# Altium schematic sheet management-i2c.SchDoc: I2C IPMI
size A3; DocumentNumber: 3; SheetNumber: 3; SheetTotal: 9
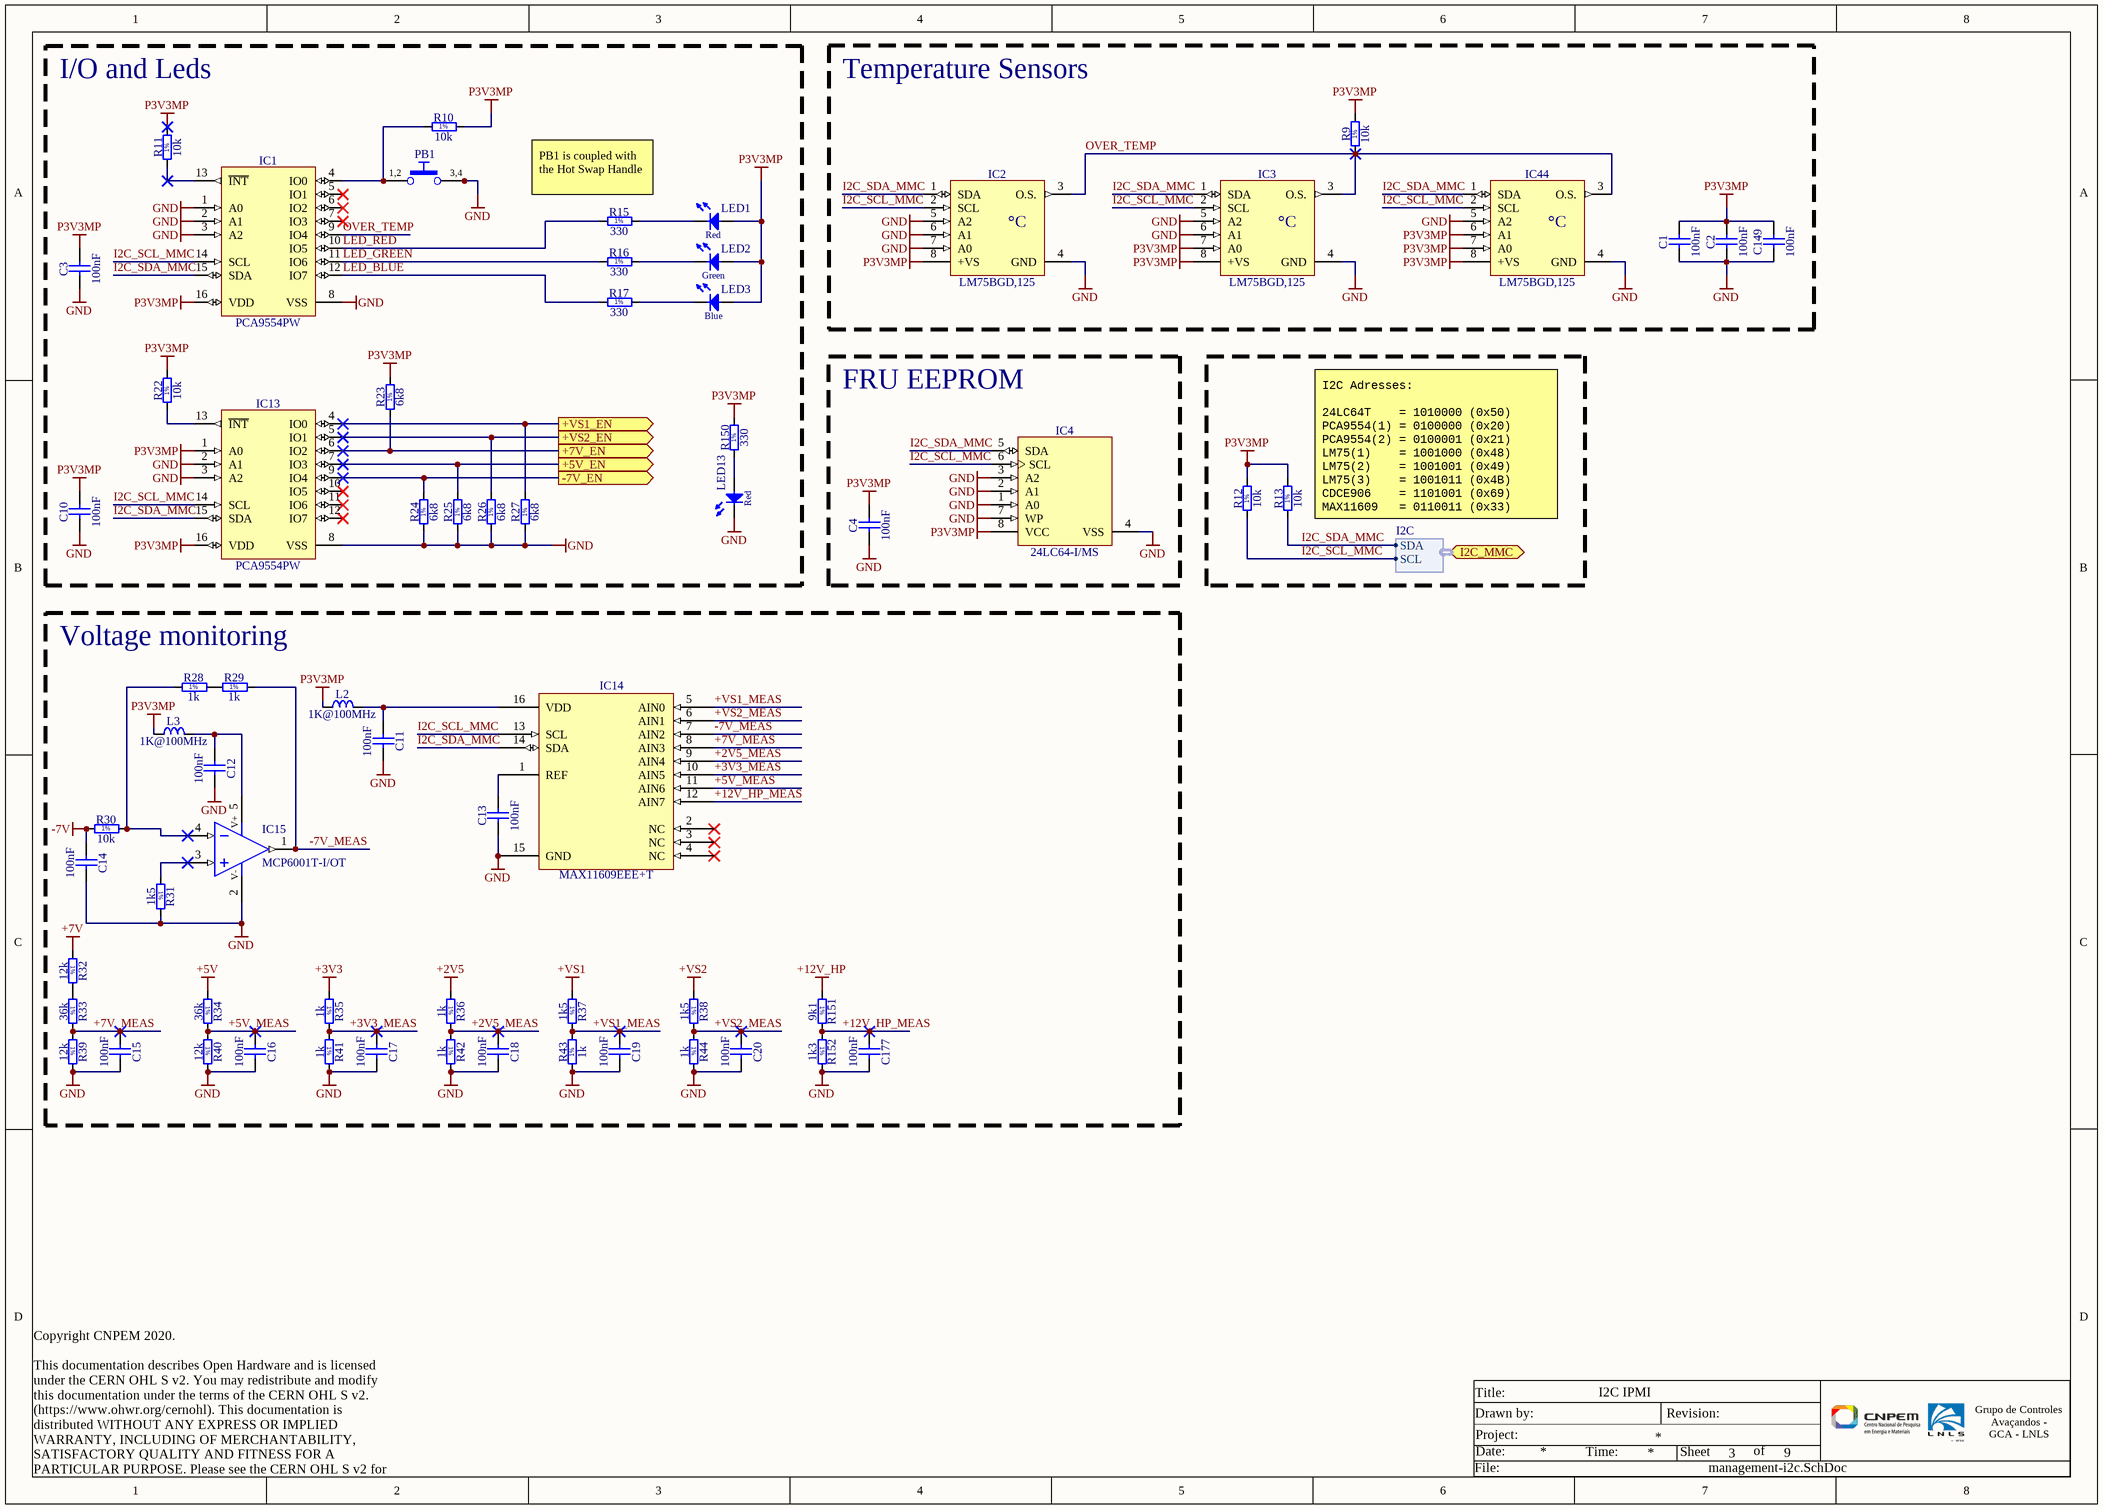
[diagram p0: management-i2c.SchDoc]

## Parts
C1  100nF  [CAPC1005X55N]
C2  100nF  [CAPC1005X55N]
C3  100nF  [CAPC1005X55N]
C4  100nF  [CAPC1005X55N]
C10  100nF  [CAPC1005X55N]
C11  100nF  [CAPC1005X55N]
C12  100nF  [CAPC1005X55N]
C13  100nF  [CAPC1005X55N]
C14  100nF  [CAPC1005X55N]
C15  100nF  [CAPC1005X55N]
C16  100nF  [CAPC1005X55N]
C17  100nF  [CAPC1005X55N]
C18  100nF  [CAPC1005X55N]
C19  100nF  [CAPC1005X55N]
C20  100nF  [CAPC1005X55N]
C149  100nF  [CAPC1005X55N]
C177  100nF  [CAPC1005X55N]
IC1  PCA9554PW  [SOP65P640X110-16N]
IC2  LM75BGD,125  [SON50P200X300X90-8N]
IC3  LM75BGD,125  [SON50P200X300X90-8N]
IC4  24LC64-I/MS  [SOP65P490X110-8N]
IC13  PCA9554PW  [SOP65P640X110-16N]
IC14  MAX11609EEE+T  [SOP65P640X110-16N]
IC15  MCP6001T-I/OT  [SOT95P270X145-5N]
IC44  LM75BGD,125  [SON50P200X300X90-8N]
L2  1K@100MHz  [INDC1608X95N]
L3  1K@100MHz  [INDC1608X95N]
LED1  Red  [LEDC1608X80N_RED]  (value not drawn)
LED2  Green  [LED_AVAGO_HSME-C120]  (value not drawn)
LED3  Blue  [LED_AVAGO_HSMR-C120]  (value not drawn)
LED13  Red  [LEDC1608X80N_RED]  (value not drawn)
PB1  Push Button  [SW_C&K_HDT0001]  (value not drawn)
R9  10k  [RESC1005X40N]
R10  10k  [RESC1005X40N]
R11  10k  [RESC1005X40N]
R12  10k  [RESC1005X40N]
R13  10k  [RESC1005X40N]
R15  330  [RESC1005X40N]
R16  330  [RESC1005X40N]
R17  330  [RESC1005X40N]
R22  10k  [RESC1005X40N]
R23  6k8  [RESC1005X40N]
R24  6k8  [RESC1005X40N]
R25  6k8  [RESC1005X40N]
R26  6k8  [RESC1005X40N]
R27  6k8  [RESC1005X40N]
R28  1k  [RESC1005X40N]
R29  1k  [RESC1005X40N]
R30  10k  [RESC1005X40N]
R31  1k5  [RESC1005X40N]
R32  12k  [RESC1005X40N]
R33  36k  [RESC1005X40N]
R34  36k  [RESC1005X40N]
R35  1k  [RESC1005X40N]
R36  1k  [RESC1005X40N]
R37  1k5  [RESC1005X40N]
R38  1k5  [RESC1005X40N]
R39  12k  [RESC1005X40N]
R40  12k  [RESC1005X40N]
R41  1k  [RESC1005X40N]
R42  1k  [RESC1005X40N]
R43  1k  [RESC1005X40N]
R44  1k  [RESC1005X40N]
R150  330  [RESC1005X40N]
R151  9k1  [RESC1005X40N]
R152  1k3  [RESC1005X40N]

## Blocks framed on the sheet
I/O and Leds: C3 C10 IC1 IC13 LED1-LED3 LED13 PB1 R10 R11 R15-R17 R22-R27 R150
Temperature Sensors: C1 C2 C149 IC2 IC3 IC44 R9
FRU EEPROM: C4 IC4
Voltage monitoring: C11-C20 C177 IC14 IC15 L2 L3 R28-R44 R151 R152

## Ports
+5V_EN (out), +7V_EN (out), +VS1_EN (out), +VS2_EN (out), -7V_EN (out), I2C_MMC (bidir, harness I2C)

## Harnesses
I2C: SDA, SCL

## Nets
+2V5: R36.1
+3V3: R35.1
+5V: R34.1
+7V: R32.1
+12V_HP: R151.1
+VS1: R37.1
+VS2: R38.1
-7V: C14.1 R30.1
GND: C1.1 C2.1 C3.1 C4.1 C10.1 C11.2 C12.2 C13.1 C14.2 C15.2 C16.2 C17.2 C18.2 C19.2 C20.2 C149.1 C177.2 IC1.1(A0) IC1.2(A1) IC1.3(A2) IC1.8(VSS) IC2.4(GND) IC2.5(A2) IC2.6(A1) IC2.7(A0) IC3.4(GND) IC3.5(A2) IC3.6(A1) IC4.1(A0) IC4.2(A1) IC4.3(A2) IC4.4(VSS) IC4.7(WP) IC13.2(A1) IC13.3(A2) IC13.8(VSS) IC14.15(GND) IC15.2(V-) IC44.4(GND) IC44.5(A2) LED13.1(C) PB1.3 PB1.4 R24.1 R25.1 R26.1 R27.1 R31.2 R39.2 R40.2 R41.2 R42.2 R43.1 R44.2 R152.2
P3V3MP: C1.2 C2.2 C3.2 C4.2 C10.2 C149.2 IC1.16(VDD) IC2.8(+VS) IC3.7(A0) IC3.8(+VS) IC4.8(VCC) IC13.1(A0) IC13.16(VDD) IC44.6(A1) IC44.7(A0) IC44.8(+VS) L2.1 L3.1 LED1.2(A) LED2.2(A) LED3.2(A) R9.2 R10.2 R11.2 R12.2 R13.2 R22.2 R23.2 R150.2
+2V5_MEAS: C18.1 IC14.9(AIN4) R36.2 R42.1
+3V3_MEAS: C17.1 IC14.10(AIN5) R35.2 R41.1
+5V_EN: IC13.7(IO3) R25.2 ; port +5V_EN
+5V_MEAS: C16.1 IC14.11(AIN6) R34.2 R40.1
+7V_EN: IC13.6(IO2) R23.1 ; port +7V_EN
+7V_MEAS: C15.1 IC14.8(AIN3) R33.2 R39.1
+12V_HP_MEAS: C177.1 IC14.12(AIN7) R151.2 R152.1
+VS1_EN: IC13.4(IO0) R27.2 ; port +VS1_EN
+VS1_MEAS: C19.1 IC14.5(AIN0) R37.2 R43.2
+VS2_EN: IC13.5(IO1) R26.2 ; port +VS2_EN
+VS2_MEAS: C20.1 IC14.6(AIN1) R38.2 R44.1
-7V_EN: IC13.9(IO4) R24.2 ; port -7V_EN
-7V_MEAS: IC14.7(AIN2) IC15.1(OUT) R29.2
I2C_SCL_MMC: IC1.14(SCL) IC2.2(SCL) IC3.2(SCL) IC4.6(SCL) IC13.14(SCL) IC14.13(SCL) IC44.2(SCL) R12.1 ; port I2C_MMC.SCL
I2C_SDA_MMC: IC1.15(SDA) IC2.1(SDA) IC3.1(SDA) IC4.5(SDA) IC13.15(SDA) IC14.14(SDA) IC44.1(SDA) R13.1 ; port I2C_MMC.SDA
LED_BLUE: IC1.12(IO7) R17.1
LED_GREEN: IC1.11(IO6) R16.1
LED_RED: IC1.10(IO5) R15.1
OVER_TEMP: IC1.9(IO4) IC2.3(O.S.) IC3.3(O.S.) IC44.3(O.S.) R9.1
NetC11_1: C11.1 IC14.16(VDD) L2.2
NetC12_1: C12.1 IC15.5(V+) L3.2
NetC13_2: C13.2 IC14.1(REF)
NetIC1_4: IC1.4(IO0) PB1.1 PB1.2 R10.1
NetIC1_13: IC1.13(~{INT}) R11.1
NetIC13_13: IC13.13(~{INT}) R22.1
NetIC15_3: IC15.3(IN+) R31.1
NetIC15_4: IC15.4(IN-) R28.1 R30.2
NetLED1_1: LED1.1(C) R15.2
NetLED2_1: LED2.1(C) R16.2
NetLED3_1: LED3.1(C) R17.2
NetLED13_2: LED13.2(A) R150.1
NetR28_2: R28.2 R29.1
NetR32_2: R32.2 R33.1

Not connected (* = marked no-connect by the designer): IC1 5(IO1)* 6(IO2)* 7(IO3)*; IC13 10(IO5)* 11(IO6)* 12(IO7)*; IC14 2(NC)* 3(NC)* 4(NC)*

## Notes on the sheet
- (near R15) PB1 is coupled with the Hot Swap Handle
- (near R13) I2C Adresses:
  24LC64T    = 1010000 (0x50)
  PCA9554(1) = 0100000 (0x20)
  PCA9554(2) = 0100001 (0x21)
  LM75(1)    = 1001000 (0x48)
  LM75(2)    = 1001001 (0x49)
  LM75(3)    = 1001011 (0x4B)
  CDCE906    = 1101001 (0x69)
  MAX11609   = 0110011 (0x33)
- Title:
- Date:
- Project:
- Drawn by:
- Time:
- Revision:
- Sheet
- of
- Grupo de Controles Avaçandos -
  GCA - LNLS
- Copyright CNPEM 2020.
  This documentation describes Open Hardware and is licensed under the CERN OHL S v2. You may redistribute and modify this documentation under the terms of the CERN OHL S v2. (https://www.ohwr.org/cernohl). This documentation is distributed WITHOUT ANY EXPRESS OR IMPLIED WARRANTY, INCLUDING OF MERCHANTABILITY, SATISFACTORY QUALITY AND FITNESS FOR A PARTICULAR PURPOSE. Please see the CERN OHL S v2 for applicable conditions.
- File:
- (in symbol LM75BGD,125) °C
- (in symbol R0402_1K3_1%_0.0625W_100PPM) 1%
- (in symbol R0402_1K5_1%_0.0625W_100PPM) 1%
- (in symbol R0402_1K_1%_0.0625W_100PPM) 1%
- (in symbol R0402_6K8_1%_0.0625W_100PPM) 1%
- (in symbol R0402_9K1_1%_0.0625W_100PPM) 1%
- (in symbol R0402_10K_1%_0.0625W_100PPM) 1%
- (in symbol R0402_12K_1%_0.0625W_100PPM) 1%
- (in symbol R0402_36K_1%_0.0625W_100PPM) 1%
- (in symbol R0402_330R_1%_0.0625W_100PPM) 1%
- (in symbol SW_C&K_HDT0001) 1,2; 3,4

## Library data of the parts
C1-C4 C10-C20 C149 C177 = CC0402_100NF_16V_10%_X7R: SMD Multilayer Chip Ceramic Capacitor; Manufacturer: GENERIC; Manufacturer1 Part Number: GRM155R71C104KA88D; Voltage: 16V; TC: X7R; Tolerance: ±10%; Part Number: CC0402_100NF_16V_10%_X7R; Component Kind: Standard; Component Type: Standard; Pin Count: 2; Value: 100nF; Status: Not Recommended; Manufacturer Part Number: CC0402_100NF_16V_10%_X7R; Case: 0402; Mounted: Yes; Socket: No; SMD: Yes; Sense: No; Manufacturer1 Example: MURATA; Manufacturer1 ComponentHeight: 0.55mm; HelpURL: \\cern.ch\dfs\Applications\Altium\Datasheets\CC0402_X7R_MURATA_GRM.pdf; Author: CERN DEM JLC; CreateDate: 05/12/2013; LatestRevisionDate: 03/12/2007
IC1 IC13 = PCA9554PW: 8-Bit I2C-Bus and SMBus I/O Port with Interrupt; Manufacturer: NXP SEMICONDUCTORS; PressFit: No; Bonding: No; Part Number: PCA9554PW; Component Kind: Standard; Component Type: Standard; Device: PCA9554PW; PackageDescription: SOP, 0.65mm pitch; 16 pin, 4.40mm W X 5.00mm L X 1.10mm H body IPC Medium Density; Manufacturer Part Number: PCA9554PW; Pin Count: 16; Case: TSSOP16; Mounted: Yes; Socket: No; SMD: Yes; Sense: No; ComponentHeight: 1.1mm; Author: CERN DEM JLC; HelpURL: \\cern.ch\dfs\Applications\Altium\Datasheets\PCA9554PW.pdf; CreateDate: 04/11/2014; LatestRevisionDate: 04/11/2014
IC2 IC3 IC44 = LM75BGD,125: I2C Digital temperature sensor and thermal watchdog; Manufacturer: NEXPERIA; PressFit: No; Bonding: No; Part Number: LM75BGD,125; Component Kind: Standard; Component Type: Standard; Device: LM75BGD,125; Footprint: XSON-8; PackageDescription: SON, 0.50mm Pitch; 8 Pin, 2.00mm W X 3.00mm L X 0.50mm H body, IPC Medium Density; Manufacturer Part Number: LM75BGD,125; Pin Count: 8; Case: XSON-8; Mounted: Yes; Socket: No; SMD: Yes; Sense: No; ComponentHeight: 0.5mm; Author: LNLS DIG AFG; CreateDate: 06/07/2020; LatestRevisionDate: 06/07/2020
IC4 = 24LC64-I/MS: 2.5V-5.5V, 64K (8K x 8-bit) I2C Serial EEPROM; Manufacturer: MICROCHIP TECHNOLOGY; Bonding: No; PressFit: No; Part Number: 24LC64-I/MS; Component Kind: Standard; Component Type: Standard; Device: 24LC64-I/MS; PackageDescription: SOP, 0.65mm pitch; 8 pin, 3.00mm W X 3.00mm L X 1.10mm H body, IPC Medium Density; Manufacturer Part Number: 24LC64-I/MS; Pin Count: 8; Case: MSOP8; Mounted: Yes; Socket: No; SMD: Yes; ComponentHeight: 1.1mm; HelpURL: \\cern.ch\dfs\Applications\Altium\Datasheets\24LC64-I-MS.pdf; Author: CERN DEM JLC; CreateDate: 24/01/2011; LatestRevisionDate: 24/01/2011; Sense: No
IC14 = MAX11609EEE+T: Low-Power, 8-Channel, I2C, 10-Bit ADC in Ultra-Small Packages; Part Description: Low-Power, 8-Channel, I2C,  10-Bit ADCs in Ultra-Small Packages; Manufacturer: MAXIM; PressFit: No; Bonding: No; Part Number: MAX11609EEE+T; Component Kind: Standard; Component Type: Standard; Device: MAX11609EEE+T; PackageDescription: SOP, 0.65mm pitch; 16 pin, 4.40mm W X 5.00mm L X 1.10mm H body IPC Medium Density; Manufacturer Part Number: MAX11609EEE+T; Pin Count: 16; Case: QSOP-16; Mounted: Yes; Socket: No; SMD: Yes; Sense: No; ComponentHeight: 1.1mm; Author: LNLS DIG AFG; CreateDate: 12/06/2020; LatestRevisionDate: 12/06/2020
IC15 = MCP6001T-I/OT: 1MHz, Low-Power, Rail-To-Rail Operational Amplifier; Manufacturer: MICROCHIP; PressFit: No; Bonding: No; Part Number: MCP6001T-I/OT; Component Kind: Standard; Component Type: Standard; Device: MCP6001T-I/OT; PackageDescription: SOT, 0.95mm Pitch; 5 Pin,1.55mm W X 2.90mm L X 1.45mm H body, IPC Medium Density; Manufacturer Part Number: MCP6001T-I/OT; Pin Count: 5; Case: SOT-5; Mounted: Yes; Socket: No; SMD: Yes; Sense: No; ComponentHeight: 1.45mm; Author: LNLS DIG AFG; CreateDate: 15/06/2020; LatestRevisionDate: 15/06/2020
L2 L3 = IND0603_MURATA_BLM18AG102SN1D: SMD EMIFIL Suppression Chip Ferrite Bead; Manufacturer: MURATA; Power: 400mA; Resistance: 0.50R; Tolerance: ±25%; Part Number: IND0603_MURATA_BLM18AG102SN1D; Component Kind: Standard; Component Type: Standard; Pin Count: 2; Value: 1K@100MHz; Status: None; Manufacturer Part Number: BLM18AG102SN1D; Case: 0603; Mounted: Yes; Socket: No; SMD: Yes; Sense: No; ComponentHeight: 0.95mm; Author: LNLS DIG GBMB; CreateDate: 03/11/2017; LatestRevisionDate: 03/11/2017
LED1 LED13 = LED_AVAGO_HSMC-C190: High Performance ChipLED; Manufacturer: AVAGO; PressFit: No; Bonding: No; Part Number: LED_AVAGO_HSMC-C190; Component Kind: Standard; Component Type: Standard; Color: Red; PackageDescription: Chip Red LED, 2-Leads, Body 1.6x0.8mm, IPC Medium Density; Manufacturer Part Number: HSMC-C190; Pin Count: 2; Mounted: Yes; Socket: No; SMD: Yes; Sense: No; ComponentHeight: 0.8mm; Author: LNLS DIG AFG; CreateDate: 04/09/2020; LatestRevisionDate: 04/09/2020
LED2 = LED_AVAGO_HSME-C120: High Performance Right Angle Chip Green LED; Manufacturer: AVAGO TECHNOLOGIES; PressFit: No; Bonding: No; Part Number: LED_AVAGO_HSME-C120; Component Kind: Standard; Component Type: Standard; Color: Green; PackageDescription: Green Chip LED, 2-Leads, Body 1.7x1.1mm, Side Emitting Package; Manufacturer Part Number: HSME-C120; Pin Count: 2; Mounted: Yes; Socket: No; SMD: Yes; Sense: No; ComponentHeight: 0.7mm; HelpURL: \\cern.ch\dfs\Applications\Altium\Datasheets\LED_AVAGO_HSME-C120.pdf; ComponentLink1URL: \\cern.ch\dfs\Applications\Altium\Datasheets\LED_AVAGO_HSME-C110_DESIGN-GUIDE.pdf; ComponentLink1Description: Design Guide; Author: CERN DEM JMW; CreateDate: 22/07/2009; LatestRevisionDate: 20/06/2012
LED3 = LED_AVAGO_HSMR-C120: High Performance Right Angle Chip InGaN Blue LED; Manufacturer: AVAGO TECHNOLOGIES; PressFit: No; Bonding: No; Part Number: LED_AVAGO_HSMR-C120; Component Kind: Standard; Component Type: Standard; Color: Blue; Footprint: LED_AVAGO_HSME-C120; PackageDescription: Blue Chip LED, 2-Leads, Body 1.7x1.1mm, Side Emitting Package; Manufacturer Part Number: HSMR-C120; Pin Count: 2; Mounted: Yes; Socket: No; SMD: Yes; Sense: No; ComponentHeight: 0.7mm; HelpURL: \\cern.ch\dfs\Applications\Altium\Datasheets\LED_AVAGO_HSMR-C120.pdf; Author: CERN DEM JLC; CreateDate: 07/07/2014; LatestRevisionDate: 07/07/2014
PB1 = SW_C&K_HDT0001: 5VDC 1mA SPST-NO Micro Mini Surface Surface Mount Detect Push-Button Switch, HDT Serie; Manufacturer: C&K; PressFit: No; Part Number: SW_C&K_HDT0001; Component Kind: Standard; Component Type: Standard; Pin Count: 4; PackageDescription: Body 3.5x2.8mm, Micro Mini Surface Mount Detect Switches, HDT Serie; Family: Push Button; Mounted: Yes; Socket: No; SMD: Yes; Status: None; Manufacturer Part Number: HDT0001; ComponentHeight: 3.35mm; HelpURL: \\cern.ch\dfs\Applications\Altium\Datasheets\SW_C&K_HDT0001.pdf; Author: CERN DEM JLC; CreateDate: 15/08/2012; LatestRevisionDate: 15/08/2012; Sense: No
R9-R13 R22 R30 = R0402_10K_1%_0.0625W_100PPM: General Purpose Thick Film Chip Resistor; Manufacturer: GENERIC; Manufacturer1 Part Number: 232270671003L; TC: ±100ppm/°C; Tolerance: ±1%; Part Number: R0402_10K_1%_0.0625W_100PPM; Component Kind: Standard; Component Type: Standard; Pin Count: 2; Value: 10k; Status: Not recommended; Power: 0.0625W; Manufacturer Part Number: R0402_10K_1%_0.0625W_100PPM; Case: 0402; Mounted: Yes; Sense: No; Socket: No; SMD: Yes; Manufacturer1 Example: YAGEO PHYCOMP; Manufacturer1 ComponentHeight: 0.4mm; HelpURL: \\cern.ch\dfs\Applications\Altium\Datasheets\R0402_Phycomp_RC0402.pdf; Author: CERN DEM JLC; CreateDate: 03/12/2007; LatestRevisionDate: 17/10/2012
R15-R17 R150 = R0402_330R_1%_0.0625W_100PPM: General Purpose Thick Film Chip Resistor; Manufacturer: GENERIC; Manufacturer1 Part Number: 232270673301L; TC: ±100ppm/°C; Tolerance: ±1%; Part Number: R0402_330R_1%_0.0625W_100PPM; Component Kind: Standard; Component Type: Standard; Pin Count: 2; Value: 330; Status: Not recommended; Power: 0.0625W; Manufacturer Part Number: R0402_330R_1%_0.0625W_100PPM; Case: 0402; Mounted: Yes; Socket: No; SMD: Yes; Manufacturer1 Example: YAGEO PHYCOMP; Manufacturer1 ComponentHeight: 0.4mm; HelpURL: \\cern.ch\dfs\Applications\Altium\Datasheets\R0402_Phycomp_RC0402.pdf; Author: CERN DEM JLC; CreateDate: 03/12/2007; LatestRevisionDate: 17/10/2012; Sense: No
R23-R27 = R0402_6K8_1%_0.0625W_100PPM: General Purpose Thick Film Chip Resistor; Manufacturer: GENERIC; Manufacturer1 Part Number: 232270676802L; TC: ±100ppm/°C; Tolerance: ±1%; Part Number: R0402_6K8_1%_0.0625W_100PPM; Component Kind: Standard; Component Type: Standard; Pin Count: 2; Value: 6k8; Status: Not recommended; Power: 0.0625W; Manufacturer Part Number: R0402_6K8_1%_0.0625W_100PPM; Case: 0402; Mounted: Yes; Sense: No; Socket: No; SMD: Yes; Manufacturer1 Example: YAGEO PHYCOMP; Manufacturer1 ComponentHeight: 0.4mm; HelpURL: \\cern.ch\dfs\Applications\Altium\Datasheets\R0402_Phycomp_RC0402.pdf; Author: CERN DEM JLC; CreateDate: 03/12/2007; LatestRevisionDate: 17/10/2012
R28 R29 R35 R36 R41-R44 = R0402_1K_1%_0.0625W_100PPM: General Purpose Thick Film Chip Resistor; Manufacturer: GENERIC; Manufacturer1 Part Number: 232270671002L; TC: ±100ppm/°C; Tolerance: ±1%; Part Number: R0402_1K_1%_0.0625W_100PPM; Component Kind: Standard; Component Type: Standard; Pin Count: 2; Value: 1k; Status: Not recommended; Power: 0.0625W; Manufacturer Part Number: R0402_1K_1%_0.0625W_100PPM; Case: 0402; Mounted: Yes; Sense: No; Socket: No; SMD: Yes; Manufacturer1 Example: YAGEO PHYCOMP; Manufacturer1 ComponentHeight: 0.4mm; HelpURL: \\cern.ch\dfs\Applications\Altium\Datasheets\R0402_Phycomp_RC0402.pdf; Author: CERN DEM JLC; CreateDate: 03/12/2007; LatestRevisionDate: 17/10/2012
R31 R37 R38 = R0402_1K5_1%_0.0625W_100PPM: General Purpose Thick Film Chip Resistor; Manufacturer: GENERIC; Manufacturer1 Part Number: 232270671502L; TC: ±100ppm/°C; Tolerance: ±1%; Part Number: R0402_1K5_1%_0.0625W_100PPM; Component Kind: Standard; Component Type: Standard; Pin Count: 2; Value: 1k5; Status: Not recommended; Power: 0.0625W; Manufacturer Part Number: R0402_1K5_1%_0.0625W_100PPM; Case: 0402; Mounted: Yes; Sense: No; Socket: No; SMD: Yes; Manufacturer1 Example: YAGEO PHYCOMP; Manufacturer1 ComponentHeight: 0.4mm; HelpURL: \\cern.ch\dfs\Applications\Altium\Datasheets\R0402_Phycomp_RC0402.pdf; Author: CERN DEM JLC; CreateDate: 03/12/2007; LatestRevisionDate: 17/10/2012
R32 R39 R40 = R0402_12K_1%_0.0625W_100PPM: General Purpose Thick Film Chip Resistor; Manufacturer: GENERIC; Manufacturer1 Part Number: 232270671203L; TC: ±100ppm/°C; Tolerance: ±1%; Part Number: R0402_12K_1%_0.0625W_100PPM; Component Kind: Standard; Component Type: Standard; Pin Count: 2; Value: 12k; Status: Not recommended; Power: 0.0625W; Manufacturer Part Number: R0402_12K_1%_0.0625W_100PPM; Case: 0402; Mounted: Yes; Sense: No; Socket: No; SMD: Yes; Manufacturer1 Example: YAGEO PHYCOMP; Manufacturer1 ComponentHeight: 0.4mm; HelpURL: \\cern.ch\dfs\Applications\Altium\Datasheets\R0402_Phycomp_RC0402.pdf; Author: CERN DEM JLC; CreateDate: 03/12/2007; LatestRevisionDate: 17/10/2012
R33 R34 = R0402_36K_1%_0.0625W_100PPM: General Purpose Thick Film Chip Resistor; Manufacturer: GENERIC; Manufacturer1 Part Number: 232270673603L; TC: ±100ppm/°C; Tolerance: ±1%; Part Number: R0402_36K_1%_0.0625W_100PPM; Component Kind: Standard; Component Type: Standard; Pin Count: 2; Value: 36k; Status: Not recommended; Power: 0.0625W; Manufacturer Part Number: R0402_36K_1%_0.0625W_100PPM; Case: 0402; Mounted: Yes; Sense: No; Socket: No; SMD: Yes; Manufacturer1 Example: YAGEO PHYCOMP; Manufacturer1 ComponentHeight: 0.4mm; HelpURL: \\cern.ch\dfs\Applications\Altium\Datasheets\R0402_Phycomp_RC0402.pdf; Author: CERN DEM JLC; CreateDate: 03/12/2007; LatestRevisionDate: 17/10/2012
R151 = R0402_9K1_1%_0.0625W_100PPM: General Purpose Thick Film Chip Resistor; Manufacturer: GENERIC; Manufacturer1 Part Number: 232270679102L; TC: ±100ppm/°C; Tolerance: ±1%; Part Number: R0402_9K1_1%_0.0625W_100PPM; Component Kind: Standard; Component Type: Standard; Pin Count: 2; Value: 9k1; Status: Not recommended; Power: 0.0625W; Manufacturer Part Number: R0402_9K1_1%_0.0625W_100PPM; Case: 0402; Mounted: Yes; Sense: No; Socket: No; SMD: Yes; Manufacturer1 Example: YAGEO PHYCOMP; Manufacturer1 ComponentHeight: 0.4mm; HelpURL: \\cern.ch\dfs\Applications\Altium\Datasheets\R0402_Phycomp_RC0402.pdf; Author: CERN DEM JLC; CreateDate: 03/12/2007; LatestRevisionDate: 17/10/2012
R152 = R0402_1K3_1%_0.0625W_100PPM: General Purpose Thick Film Chip Resistor; Manufacturer: GENERIC; Manufacturer1 Part Number: 232270671302L; TC: ±100ppm/°C; Tolerance: ±1%; Part Number: R0402_1K3_1%_0.0625W_100PPM; Component Kind: Standard; Component Type: Standard; Pin Count: 2; Value: 1k3; Status: Not recommended; Power: 0.0625W; Manufacturer Part Number: R0402_1K3_1%_0.0625W_100PPM; Case: 0402; Mounted: Yes; Sense: No; Socket: No; SMD: Yes; Manufacturer1 Example: YAGEO PHYCOMP; Manufacturer1 ComponentHeight: 0.4mm; HelpURL: \\cern.ch\dfs\Applications\Altium\Datasheets\R0402_Phycomp_RC0402.pdf; Author: CERN DEM JLC; CreateDate: 03/12/2007; LatestRevisionDate: 17/10/2012